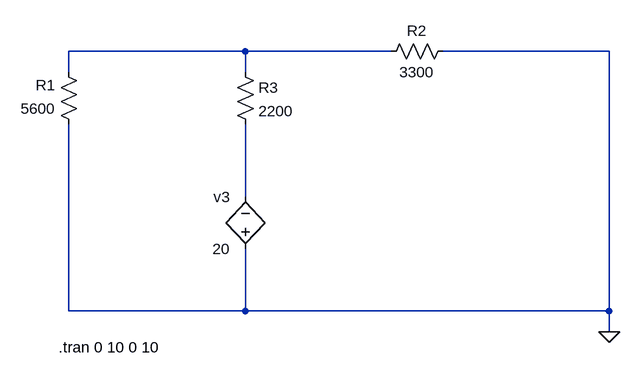
[diagram p0: schematic questão2v3.asc]
questão2v3.asc, the LTspice schematic file:
Version 4
SHEET 1 880 680
WIRE 272 96 0 96
WIRE 496 96 272 96
WIRE 832 96 576 96
WIRE 0 128 0 96
WIRE 272 128 272 96
WIRE 272 320 272 208
WIRE 0 496 0 208
WIRE 272 496 272 400
WIRE 272 496 0 496
WIRE 832 496 832 96
WIRE 832 496 272 496
WIRE 832 528 832 496
FLAG 832 528 0
SYMBOL res 16 224 R180
WINDOW 0 36 76 Left 2
WINDOW 3 36 40 Left 2
SYMATTR InstName R1
SYMATTR Value 5600
SYMBOL res 256 112 R0
SYMATTR InstName R3
SYMATTR Value 2200
SYMBOL res 480 112 R270
WINDOW 0 32 56 VTop 2
WINDOW 3 0 56 VBottom 2
SYMATTR InstName R2
SYMATTR Value 3300
SYMBOL bv 272 416 R180
WINDOW 0 24 96 Left 2
WINDOW 3 24 16 Left 2
SYMATTR InstName v3
SYMATTR Value 20
SYMATTR Prefix v
TEXT -16 552 Left 2 !.tran 0 10 0 10

The netlist it stands for:
* questão2v3.asc
R1 0 N001 5600
R3 N001 N002 2200
R2 N001 0 3300
v3 0 N002 20
.tran 0 10 0 10
.backanno
.end